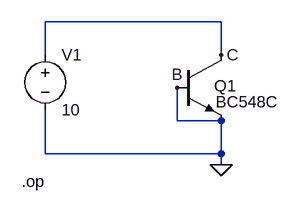
[diagram p0: schematic Draft3.asc]
Draft3.asc, the LTspice schematic file:
Version 4
SHEET 1 5124 680
WIRE 192 64 -64 64
WIRE -64 112 -64 64
WIRE 192 112 192 64
WIRE 128 208 128 160
WIRE 192 208 128 208
WIRE -64 256 -64 192
WIRE 192 256 192 208
WIRE 192 256 -64 256
WIRE 192 272 192 256
FLAG 192 272 0
FLAG 192 112 C
FLAG 128 160 B
SYMBOL npn 128 112 R0
WINDOW 0 54 45 Left 2
SYMATTR InstName Q1
SYMATTR Value BC548C
SYMBOL voltage -64 96 R0
SYMATTR InstName V1
SYMATTR Value 10
TEXT -98 296 Left 2 !.op

The netlist it stands for:
* Draft3.asc
Q1 C 0 0 0 BC548C
V1 C 0 10
.model NPN NPN
.model PNP PNP
.lib standard.bjt
.op
.backanno
.end